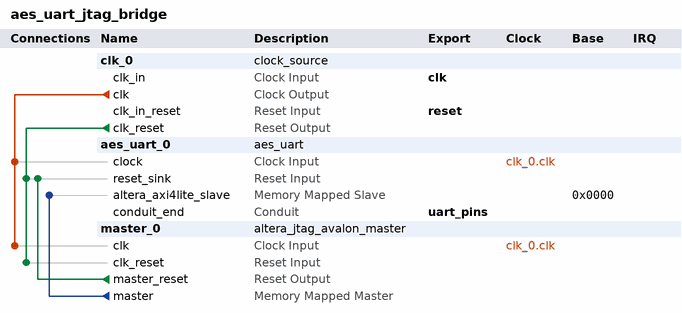
[diagram p0: system contents]
# Platform Designer (Qsys) system aes_uart_jtag_bridge, Cyclone IV E EP4CE115F29C7
# Parameters at their usual value, and those the tool derives, are not listed.
package require -exact qsys 18.0
create_system aes_uart_jtag_bridge
set_project_property DEVICE_FAMILY {Cyclone IV E}
set_project_property DEVICE EP4CE115F29C7

add_instance clk_0 clock_source 18.0
set_instance_parameter_value clk_0 clockFrequency 50000000

add_instance aes_uart_0 aes_uart 1.0
set_instance_parameter_value aes_uart_0 ADDR_W 32
set_instance_parameter_value aes_uart_0 DATA_W 32

add_instance master_0 altera_jtag_avalon_master 18.0

# connections
add_connection clk_0.clk aes_uart_0.clock clock
add_connection clk_0.clk master_0.clk clock
add_connection clk_0.clk_reset aes_uart_0.reset_sink reset
add_connection clk_0.clk_reset master_0.clk_reset reset
add_connection master_0.master_reset aes_uart_0.reset_sink reset
add_connection master_0.master aes_uart_0.altera_axi4lite_slave avalon
set_connection_parameter_value master_0.master/aes_uart_0.altera_axi4lite_slave baseAddress 0x0000

# exported interfaces
add_interface clk clock sink
set_interface_property clk EXPORT_OF clk_0.clk_in
add_interface reset reset sink
set_interface_property reset EXPORT_OF clk_0.clk_in_reset
add_interface uart_pins conduit end
set_interface_property uart_pins EXPORT_OF aes_uart_0.conduit_end

set_interconnect_requirement {$system} qsys_mm.clockCrossingAdapter HANDSHAKE
set_interconnect_requirement {$system} qsys_mm.enableEccProtection FALSE
set_interconnect_requirement {$system} qsys_mm.insertDefaultSlave FALSE
set_interconnect_requirement {$system} qsys_mm.maxAdditionalLatency 1

save_system aes_uart_jtag_bridge.qsys
